# Altium schematic sheet Sheet1.SchDoc
size A4
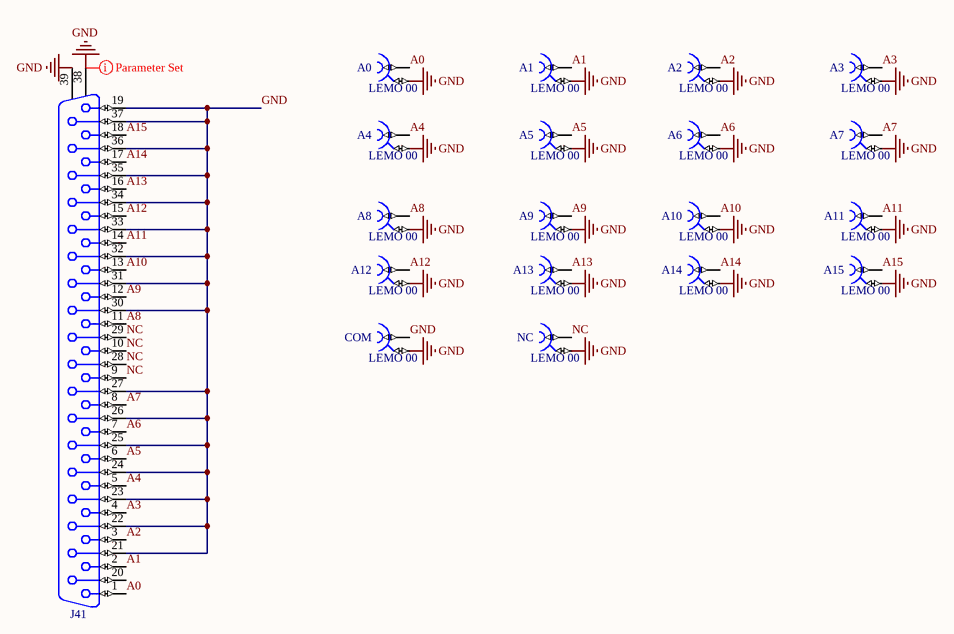
[diagram p0: Sheet1.SchDoc]

## Parts
A0  LEMO 00  [LEMO_EPA.00.250.NTN]
A1  LEMO 00  [LEMO_EPA.00.250.NTN]
A2  LEMO 00  [LEMO_EPA.00.250.NTN]
A3  LEMO 00  [LEMO_EPA.00.250.NTN]
A4  LEMO 00  [LEMO_EPA.00.250.NTN]
A5  LEMO 00  [LEMO_EPA.00.250.NTN]
A6  LEMO 00  [LEMO_EPA.00.250.NTN]
A7  LEMO 00  [LEMO_EPA.00.250.NTN]
A8  LEMO 00  [LEMO_EPA.00.250.NTN]
A9  LEMO 00  [LEMO_EPA.00.250.NTN]
A10  LEMO 00  [LEMO_EPA.00.250.NTN]
A11  LEMO 00  [LEMO_EPA.00.250.NTN]
A12  LEMO 00  [LEMO_EPA.00.250.NTN]
A13  LEMO 00  [LEMO_EPA.00.250.NTN]
A14  LEMO 00  [LEMO_EPA.00.250.NTN]
A15  LEMO 00  [LEMO_EPA.00.250.NTN]
COM  LEMO 00  [LEMO_EPA.00.250.NTN]
J41  D-SUB37F  [NORCOMP_172-037-242R011]  (value not drawn)
NC  LEMO 00  [LEMO_EPA.00.250.NTN]

## Nets
GND: A0.2 A1.2 A2.2 A3.2 A4.2 A5.2 A6.2 A7.2 A8.2 A9.2 A10.2 A11.2 A12.2 A13.2 A14.2 A15.2 COM.1 COM.2 J41.19 J41.21 J41.22 J41.23 J41.24 J41.25 J41.26 J41.27 J41.30 J41.31 J41.32 J41.33 J41.34 J41.35 J41.36 J41.37 J41.38 J41.39 NC.2
A0: A0.1 J41.1
A1: A1.1 J41.2
A2: A2.1 J41.3
A3: A3.1 J41.4
A4: A4.1 J41.5
A5: A5.1 J41.6
A6: A6.1 J41.7
A7: A7.1 J41.8
A8: A8.1 J41.11
A9: A9.1 J41.12
A10: A10.1 J41.13
A11: A11.1 J41.14
A12: A12.1 J41.15
A13: A13.1 J41.16
A14: A14.1 J41.17
A15: A15.1 J41.18
NC: J41.9 J41.10 J41.28 J41.29 NC.1

Not connected (* = marked no-connect by the designer): J41 20

## Layout directives
rule Routing Layers [TopLayer - DisabledBottomLayer - Enabled ]: GND

## Library data of the parts
A0-A15 COM NC = LEMO_EPA.00.250.NTN: Part Description: Size 00, 50 Ohms Coaxial Straight socket; PressFit: No; SCEM: 09.46.11.184.2; Part Number: LEMO_EPA.00.250.NTN; Component Kind: Standard; Component Type: Standard; Pin Count: 2; Family: LEMO 00; Mounted: Yes; Socket: No; SMD: No; Sense: No; Status: None; Manufacturer: LEMO; Manufacturer Part Number: EPA.00.250.NTN; ComponentHeight: 14mm; HelpURL: \\cern.ch\dfs\Applications\Altium\Datasheets\LEMO_EPA.00.250.NTN.pdf; Author: CERN DEM JLC; CreateDate: 22/04/2008; LatestRevisionDate: 22/04/2008
J41 = NORCOMP_172-037-242R011: Connector D-sub 37 Female; Part Description: Straight Wire Wrap D-Sub 37 Contacts Female Connector With 0.065"Clinch Nut (Board Side); PressFit: No; Part Number: NORCOMP_172-037-242R011; Component Kind: Standard; Component Type: Standard; Pin Count: 39; Family: D-SUB37F; Mounted: Yes; Socket: No; SMD: No; Sense: No; Status: None; Manufacturer: NORCOMP; Manufacturer Part Number: 172-037-242R011; ComponentHeight: 12.08mm; HelpURL: \\cern.ch\dfs\Applications\Altium\Datasheets\NORCOMP_172-037-242R011.pdf; Author: CERN DEM MR; CreateDate: 24/03/2016; LatestRevisionDate: 24/03/2016